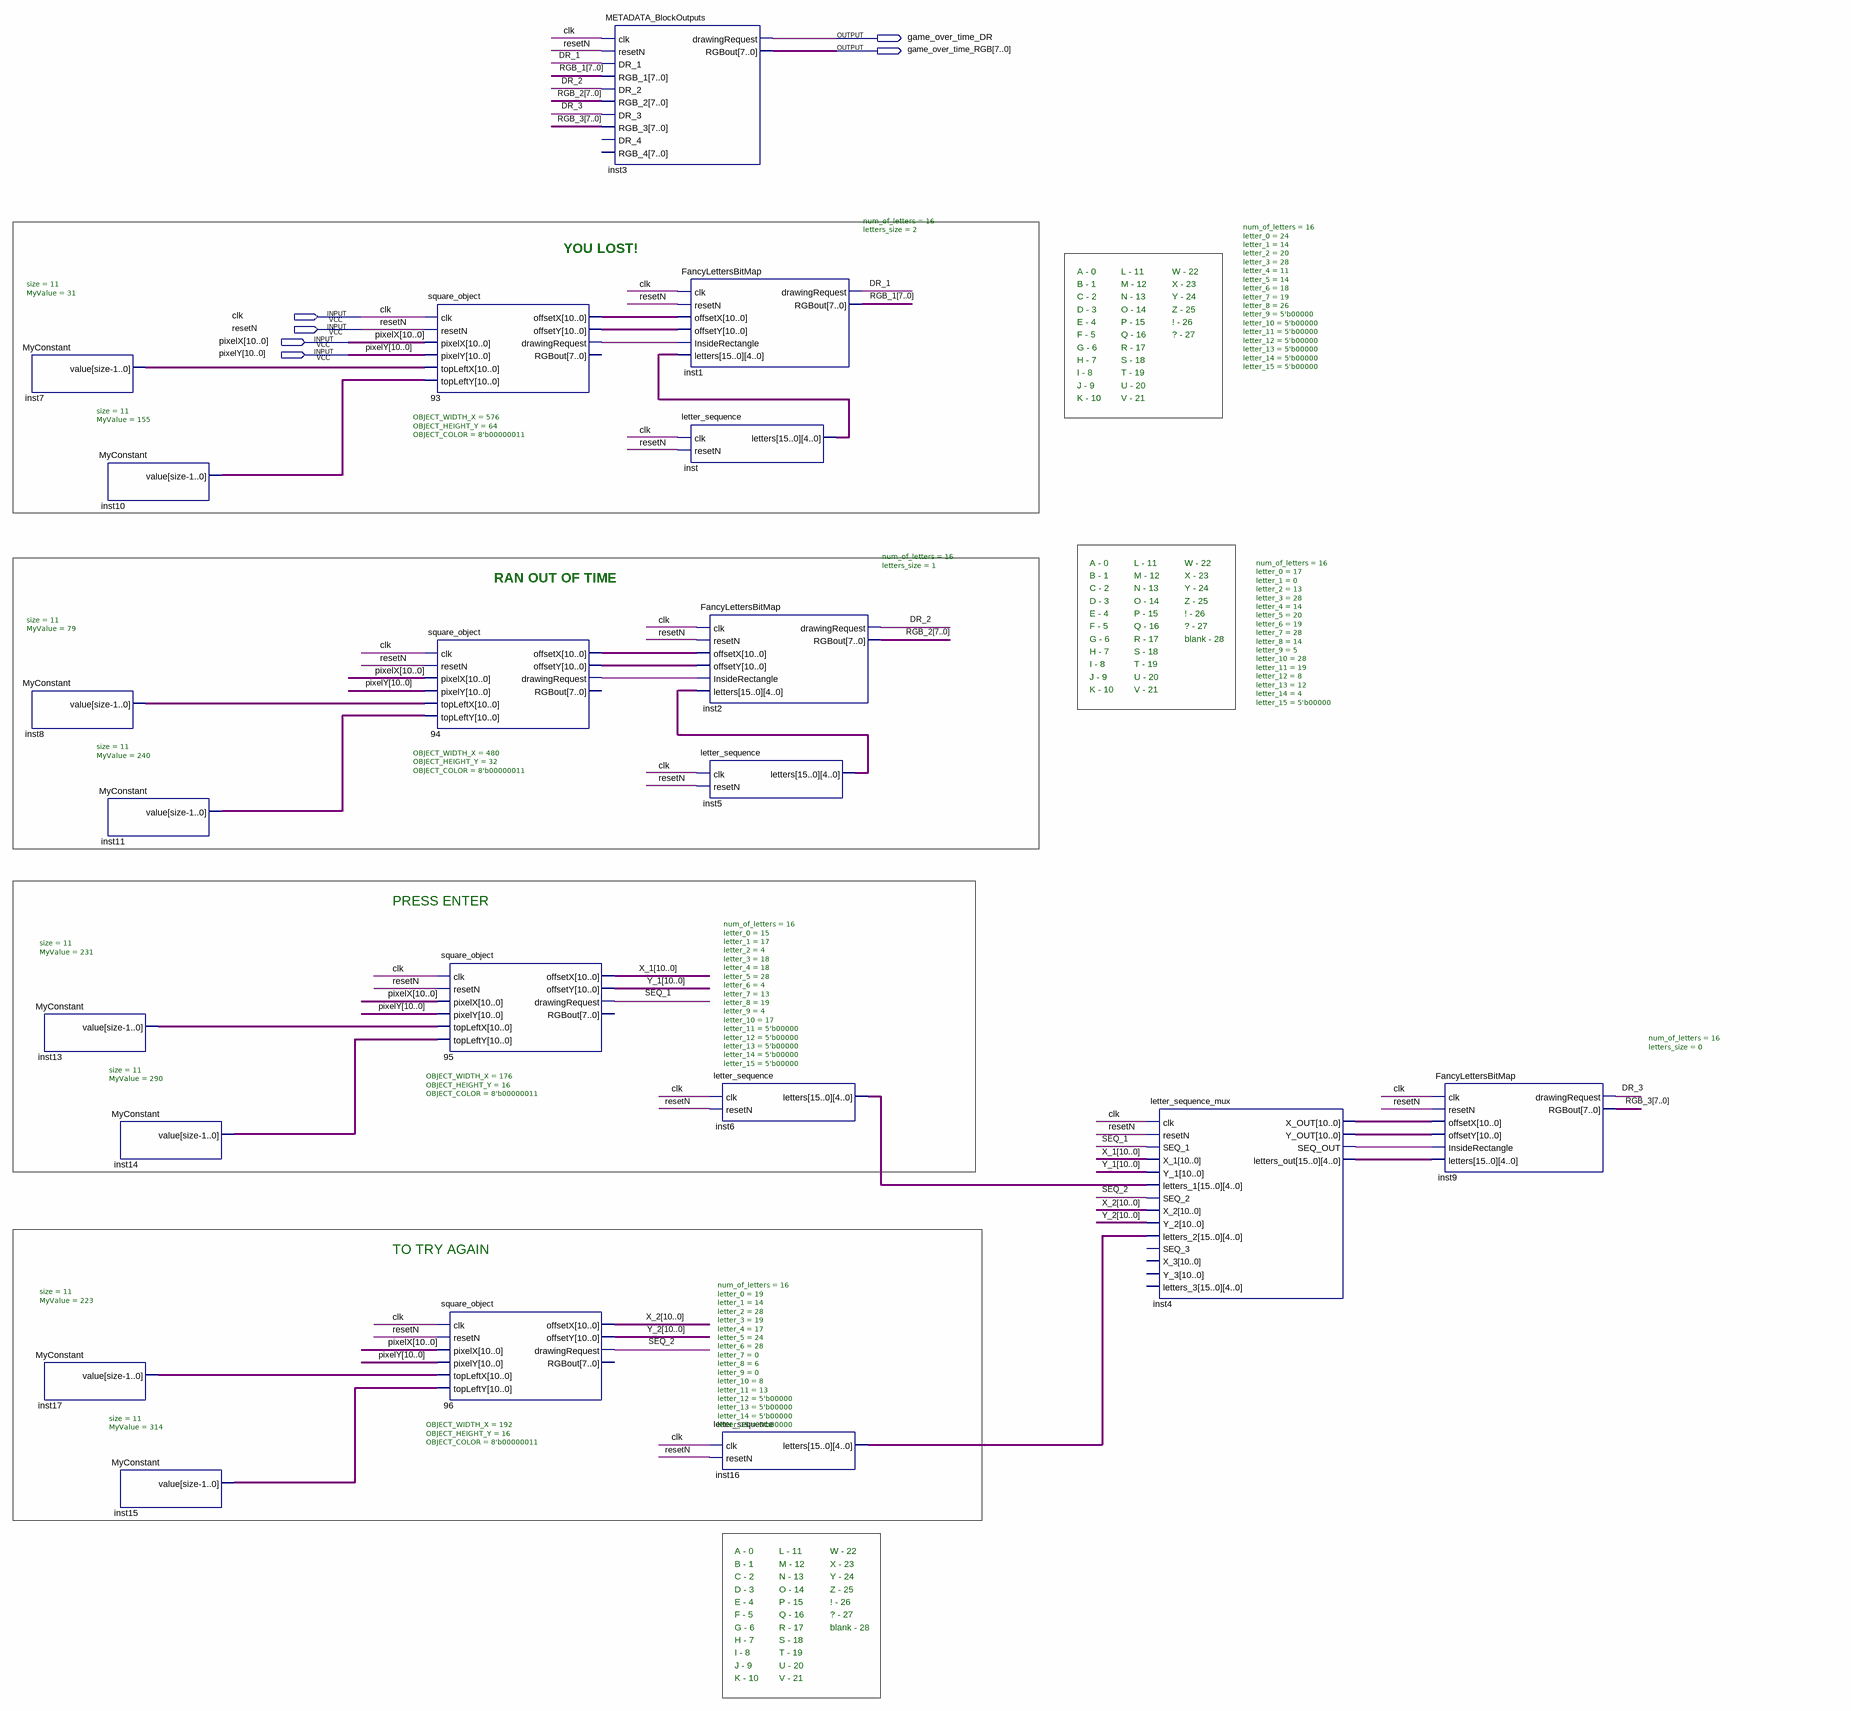
[diagram p0: schematic sheet]
// Quartus schematic Game_Over_Time_Screen_Block.bdf as structural Verilog: 21 symbols, 6 pins
module Game_Over_Time_Screen_Block (
  input  clk,
  input  resetN,
  input  [10:0] pixelX,
  input  [10:0] pixelY,
  output game_over_time_DR,
  output [7:0] game_over_time_RGB
);

  wire DR_1, DR_2, DR_3, inst4_seq_out, n93_drawingrequest, n94_drawingrequest, SEQ_1, SEQ_2;
  wire [7:0] RGB_1, RGB_2, RGB_3;
  wire [10:0] inst4_x_out, inst4_y_out, inst7_value, inst8_value, inst10_value, inst11_value, inst13_value,
       inst14_value, inst15_value, inst17_value, n93_offsetx, n93_offsety, n94_offsetx, n94_offsety, X_1,
       X_2, Y_1, Y_2;
  wire [79:0] inst4_letters_out, inst5_letters, inst6_letters, inst16_letters, inst_letters;

  MyConstant #(.size(11), .MyValue(31)) inst7 (.value(inst7_value));
  MyConstant #(.size(11), .MyValue(79)) inst8 (.value(inst8_value));
  MyConstant #(.size(11), .MyValue(231)) inst13 (.value(inst13_value));
  MyConstant #(.size(11), .MyValue(223)) inst17 (.value(inst17_value));
  MyConstant #(.size(11), .MyValue(155)) inst10 (.value(inst10_value));
  MyConstant #(.size(11), .MyValue(240)) inst11 (.value(inst11_value));
  MyConstant #(.size(11), .MyValue(290)) inst14 (.value(inst14_value));
  MyConstant #(.size(11), .MyValue(314)) inst15 (.value(inst15_value));
  square_object #(.OBJECT_WIDTH_X(576), .OBJECT_HEIGHT_Y(64), .OBJECT_COLOR(8'b00000011)) u_93 (
    .clk(clk), .resetN(resetN), .pixelX(pixelX), .pixelY(pixelY), .topLeftX(inst7_value),
    .topLeftY(inst10_value), .offsetX(n93_offsetx), .offsetY(n93_offsety), .drawingRequest(n93_drawingrequest));  // open: RGBout
  square_object #(.OBJECT_WIDTH_X(480), .OBJECT_HEIGHT_Y(32), .OBJECT_COLOR(8'b00000011)) u_94 (
    .clk(clk), .resetN(resetN), .pixelX(pixelX), .pixelY(pixelY), .topLeftX(inst8_value),
    .topLeftY(inst11_value), .offsetX(n94_offsetx), .offsetY(n94_offsety), .drawingRequest(n94_drawingrequest));  // open: RGBout
  square_object #(.OBJECT_WIDTH_X(176), .OBJECT_HEIGHT_Y(16), .OBJECT_COLOR(8'b00000011)) u_95 (
    .clk(clk), .resetN(resetN), .pixelX(pixelX), .pixelY(pixelY), .topLeftX(inst13_value),
    .topLeftY(inst14_value), .offsetX(X_1), .offsetY(Y_1), .drawingRequest(SEQ_1));  // open: RGBout
  square_object #(.OBJECT_WIDTH_X(192), .OBJECT_HEIGHT_Y(16), .OBJECT_COLOR(8'b00000011)) u_96 (
    .clk(clk), .resetN(resetN), .pixelX(pixelX), .pixelY(pixelY), .topLeftX(inst17_value),
    .topLeftY(inst15_value), .offsetX(X_2), .offsetY(Y_2), .drawingRequest(SEQ_2));  // open: RGBout
  METADATA_BlockOutputs inst3 (
    .clk(clk), .resetN(resetN), .DR_1(DR_1), .RGB_1(RGB_1), .DR_2(DR_2), .RGB_2(RGB_2), .DR_3(DR_3),
    .RGB_3(RGB_3), .drawingRequest(game_over_time_DR), .RGBout(game_over_time_RGB));  // open: DR_4, RGB_4
  FancyLettersBitMap #(.num_of_letters(16), .letters_size(2)) inst1 (
    .clk(clk), .resetN(resetN), .offsetX(n93_offsetx), .offsetY(n93_offsety),
    .InsideRectangle(n93_drawingrequest), .letters(inst_letters), .drawingRequest(DR_1), .RGBout(RGB_1));
  letter_sequence #(.num_of_letters(16), .letter_0(24), .letter_1(14), .letter_2(20), .letter_3(28), .letter_4(11), .letter_5(14), .letter_6(18), .letter_7(19), .letter_8(26), .letter_9(5'b00000), .letter_10(5'b00000), .letter_11(5'b00000), .letter_12(5'b00000), .letter_13(5'b00000), .letter_14(5'b00000), .letter_15(5'b00000)) inst (
    .clk(clk), .resetN(resetN), .letters(inst_letters));
  FancyLettersBitMap #(.num_of_letters(16), .letters_size(1)) inst2 (
    .clk(clk), .resetN(resetN), .offsetX(n94_offsetx), .offsetY(n94_offsety),
    .InsideRectangle(n94_drawingrequest), .letters(inst5_letters), .drawingRequest(DR_2), .RGBout(RGB_2));
  letter_sequence #(.num_of_letters(16), .letter_0(17), .letter_1(0), .letter_2(13), .letter_3(28), .letter_4(14), .letter_5(20), .letter_6(19), .letter_7(28), .letter_8(14), .letter_9(5), .letter_10(28), .letter_11(19), .letter_12(8), .letter_13(12), .letter_14(4), .letter_15(5'b00000)) inst5 (
    .clk(clk), .resetN(resetN), .letters(inst5_letters));
  letter_sequence #(.num_of_letters(16), .letter_0(15), .letter_1(17), .letter_2(4), .letter_3(18), .letter_4(18), .letter_5(28), .letter_6(4), .letter_7(13), .letter_8(19), .letter_9(4), .letter_10(17), .letter_11(5'b00000), .letter_12(5'b00000), .letter_13(5'b00000), .letter_14(5'b00000), .letter_15(5'b00000)) inst6 (
    .clk(clk), .resetN(resetN), .letters(inst6_letters));
  letter_sequence #(.num_of_letters(16), .letter_0(19), .letter_1(14), .letter_2(28), .letter_3(19), .letter_4(17), .letter_5(24), .letter_6(28), .letter_7(0), .letter_8(6), .letter_9(0), .letter_10(8), .letter_11(13), .letter_12(5'b00000), .letter_13(5'b00000), .letter_14(5'b00000), .letter_15(5'b00000)) inst16 (
    .clk(clk), .resetN(resetN), .letters(inst16_letters));
  letter_sequence_mux inst4 (
    .clk(clk), .resetN(resetN), .SEQ_1(SEQ_1), .X_1(X_1), .Y_1(Y_1), .letters_1(inst6_letters),
    .SEQ_2(SEQ_2), .X_2(X_2), .Y_2(Y_2), .letters_2(inst16_letters), .X_OUT(inst4_x_out),
    .Y_OUT(inst4_y_out), .SEQ_OUT(inst4_seq_out), .letters_out(inst4_letters_out));  // open: SEQ_3, X_3, Y_3, letters_3
  FancyLettersBitMap #(.num_of_letters(16), .letters_size(0)) inst9 (
    .clk(clk), .resetN(resetN), .offsetX(inst4_x_out), .offsetY(inst4_y_out),
    .InsideRectangle(inst4_seq_out), .letters(inst4_letters_out), .drawingRequest(DR_3), .RGBout(RGB_3));

  // Notes on the sheet:
  //   YOU LOST!
  //   A - 0
  //   L - 11
  //   W - 22
  //   B - 1
  //   M - 12
  //   X - 23
  //   C - 2
  //   N - 13
  //   Y - 24
  //   D - 3
  //   O - 14
  //   Z - 25
  //   E - 4
  //   P - 15
  //   ! - 26
  //   F - 5
  //   Q - 16
  //   ? - 27
  //   G - 6
  //   R - 17
  //   H - 7
  //   S - 18
  //   I - 8
  //   T - 19
  //   J - 9
  //   U - 20
  //   K - 10
  //   V - 21
  //   A - 0
  //   L - 11
  //   W - 22
  //   RAN OUT OF TIME
  //   B - 1
  //   M - 12
  //   X - 23
  //   C - 2
  //   N - 13
  //   Y - 24
  //   D - 3
  //   O - 14
  //   Z - 25
  //   E - 4
  //   P - 15
  //   ! - 26
  //   F - 5
  //   Q - 16
  //   ? - 27
  //   G - 6
  //   R - 17
  //   blank - 28
  //   H - 7
  //   S - 18
  //   I - 8
  //   T - 19
  //   J - 9
  //   U - 20
  //   K - 10
  //   V - 21
  //   PRESS ENTER
  //   TO TRY AGAIN
  //   A - 0
  //   L - 11
  //   W - 22
  //   B - 1
  //   M - 12
  //   X - 23
  //   C - 2
  //   N - 13
  //   Y - 24
  //   D - 3
  //   O - 14
  //   Z - 25
  //   E - 4
  //   P - 15
  //   ! - 26
  //   F - 5
  //   Q - 16
  //   ? - 27
  //   G - 6
  //   R - 17
  //   blank - 28
  //   H - 7
  //   S - 18
  //   I - 8
  //   T - 19
  //   J - 9
  //   U - 20
  //   K - 10
  //   V - 21
endmodule
